# Altium schematic sheet Ethernet.SchDoc: Ethernet PHY with RJ45 connector
size A4; Author: A.B; CompanyName: STMicroelectronics; Address1: 12, Rue Jules HOROWITZ; Address2: 38019 Grenoble; Address3: FRANCE; DocumentNumber: MB1137; Revision: B-01; SheetNumber: 5; SheetTotal: 6; Project: NUCLEO-XXXXZX
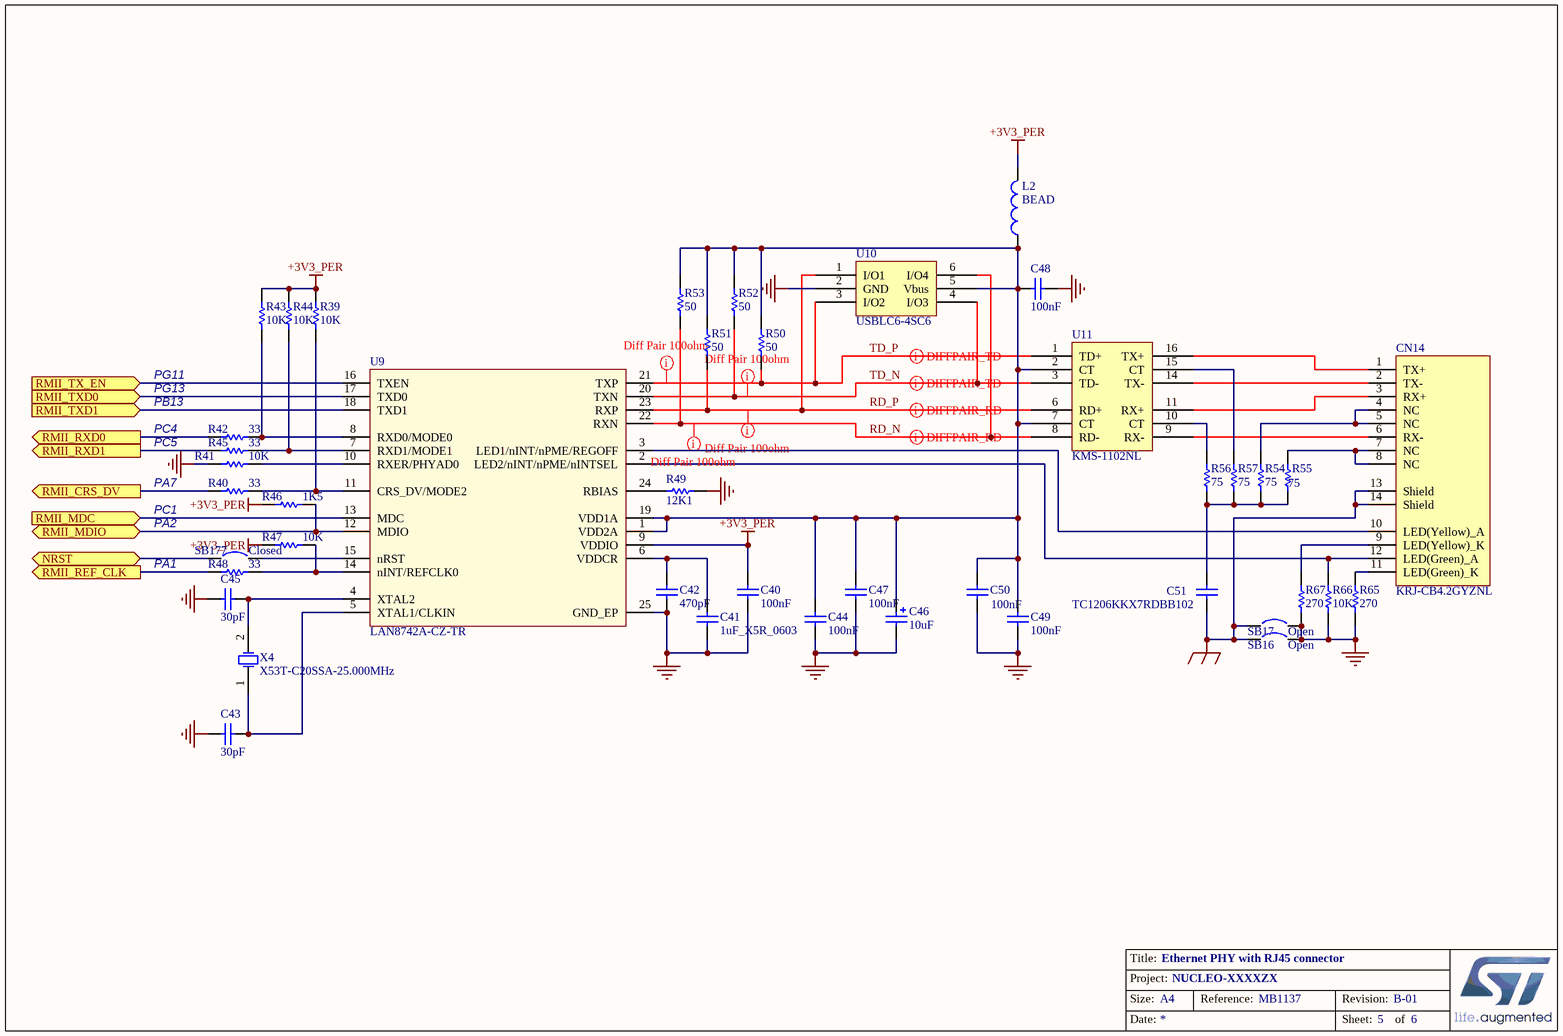
[diagram p0: Ethernet.SchDoc]

## Parts
C40  100nF  [0603C]
C41  1uF_X5R_0603  [0603C]
C42  470pF  [0603C]
C43  30pF  [0603C]
C44  100nF  [0603C]
C45  30pF  [0603C]
C46  10uF  [TAN-A]
C47  100nF  [0603C]
C48  100nF  [0603C]
C49  100nF  [0603C]
C50  100nF  [0603C]
C51  TC1206KKX7RDBB102  [1206C]
CN14  KRJ-CB4.2GYZNL  [RJ45_KRJ-CB4.2GYZNL]
L2  BEAD  [0603L]
R39  10K  [0603R]
R40  33  [0603R]
R41  10K  [0603R]
R42  33  [0603R]
R43  10K  [0603R]
R44  10K  [0603R]
R45  33  [0603R]
R46  1K5  [0603R]
R47  10K  [0603R]
R48  33  [0603R]
R49  12K1  [0603R]
R50  50  [0603R]
R51  50  [0603R]
R52  50  [0603R]
R53  50  [0603R]
R54  75  [0603R]
R55  75  [0603R]
R56  75  [0603R]
R57  75  [0603R]
R65  270  [0603R]
R66  10K  [0603R]
R67  270  [0603R]
SB16  Open  [SB_0603]
SB17  Open  [SB_0603]
SB177  Closed  [SB_0603]
U9  LAN8742A-CZ-TR  [QFN24_0R5_4X4]
U10  USBLC6-4SC6  [SOT23-6L]
U11  KMS-1102NL  [Transformer]
X4  X53T-C20SSA-25.000MHz  [XTAL_2SM_5R0X3R2]

## Ports
NRST, RMII_CRS_DV (out), RMII_MDC (in), RMII_MDIO (bidir), RMII_REF_CLK (out), RMII_RXD0 (out), RMII_RXD1 (out), RMII_TX_EN (in), RMII_TXD0 (in), RMII_TXD1 (in)

## Nets
+3V3_PER: C40.2 L2.2 R39.1 R43.1 R44.1 R46.2 R47.1 U9.9(VDDIO)
EGND: C51.1 CN14.13(Shield) CN14.14(Shield) SB16.1 SB17.1
GND: C40.1 C41.2 C42.1 C43.2 C44.1 C45.2 C46.2 C47.1 C48.1 C49.1 C50.1 R41.2 R49.2 R65.2 R66.2 R67.2 SB16.2 SB17.2 U9.25(GND_EP) U10.2(GND)
NRST: SB177.1 ; port NRST
RD_N: R53.1 U9.22(RXN) U10.6(I/O4) U11.8(RD-)
RD_P: R51.1 U9.23(RXP) U10.1(I/O1) U11.6(RD+)
RMII_CRS_DV: R40.2 ; port RMII_CRS_DV
RMII_MDC: U9.13(MDC) ; port RMII_MDC
RMII_MDIO: R46.1 U9.12(MDIO) ; port RMII_MDIO
RMII_REF_CLK: R48.2 ; port RMII_REF_CLK
RMII_RXD0: R42.2 ; port RMII_RXD0
RMII_RXD1: R45.2 ; port RMII_RXD1
RMII_TX_EN: U9.16(TXEN) ; port RMII_TX_EN
RMII_TXD0: U9.17(TXD0) ; port RMII_TXD0
RMII_TXD1: U9.18(TXD1) ; port RMII_TXD1
TD_N: R52.1 U9.20(TXN) U10.4(I/O3) U11.3(TD-)
TD_P: R50.1 U9.21(TXP) U10.3(I/O2) U11.1(TD+)
NetC41_1: C41.1 C42.2 U9.6(VDDCR)
NetC43_1: C43.1 U9.5(XTAL1/CLKIN) X4.1(OSC1)
NetC44_2: C44.2 C46.1 C47.2 C48.2 C49.2 C50.2 L2.1 R50.2 R51.2 R52.2 R53.2 U9.1(VDD2A) U9.19(VDD1A) U10.5(Vbus) U11.2(CT) U11.7(CT)
NetC45_1: C45.1 U9.4(XTAL2) X4.2(OSC2)
NetC51_2: C51.2 R54.1 R55.1 R56.1 R57.1
NetCN14_1: CN14.1(TX+) U11.16(TX+)
NetCN14_2: CN14.2(TX-) U11.14(TX-)
NetCN14_3: CN14.3(RX+) U11.11(RX+)
NetCN14_4: CN14.4(NC) CN14.5(NC) R54.2
NetCN14_6: CN14.6(RX-) U11.9(RX-)
NetCN14_7: CN14.7(NC) CN14.8(NC) R55.2
NetCN14_9: CN14.9(LED(Yellow)_K) R67.1
NetCN14_10: CN14.10(LED(Yellow)_A) U9.3(LED1/nINT/nPME/REGOFF)
NetCN14_11: CN14.11(LED(Green)_K) R65.1
NetCN14_12: CN14.12(LED(Green)_A) R66.1 U9.2(LED2/nINT/nPME/nINTSEL)
NetR39_2: R39.2 R40.1 U9.11(CRS_DV/MODE2)
NetR41_1: R41.1 U9.10(RXER/PHYAD0)
NetR42_1: R42.1 R43.2 U9.8(RXD0/MODE0)
NetR44_2: R44.2 R45.1 U9.7(RXD1/MODE1)
NetR47_2: R47.2 R48.1 U9.14(nINT/REFCLK0)
NetR49_1: R49.1 U9.24(RBIAS)
NetR56_2: R56.2 U11.10(CT)
NetR57_2: R57.2 U11.15(CT)
NetSB177_2: SB177.2 U9.15(nRST)

## Layout directives
differential pair: RD_N, RD_P, TD_N, TD_P
rule Matched Net Lengths [Tolerance = 100mil]: RD_N, RD_P, TD_N, TD_P

## Notes on the sheet
- PG11
- PG13
- PB13
- PC4
- PC5
- PA7
- PC1
- PA2
- PA1
- Title:
- Project:
- Size:
- Date:
- A4
- Reference:
- Sheet:
- Revision:
- of

## Library data of the parts
C40 C44 C47-C50 = Capacitor_ST: Capacitor 0402 / 0603 / 0805; Revision: July-2002: Re-released for DXP Platform.; Value: 100nF
C41 = CAP SMD 0603  X5R 1µF 25V 10%: 0603  X5R 1µF; Rated voltage: 25V; Tolerance: 10%; Manufacturer: *; Manufacturer P/N: *; Order code Farnell: 1288202RL; Value: 1µF; Power: *; Technology: X5R; Temperature  Factor: *; Temperature Max: +125°C; Temperature Min: -55°C; STS Code: *
C42 C43 C45 = Capacitor_ST: Capacitor 0402 / 0603 / 0805; Value: 100nF; Revision: July-2002: Re-released for DXP Platform.
C46 = Cap_10uF_POL_10%_TANA: Polarized Capacitor,10uF,10V,10%,typeA,VISHAY; Manuf_Part_1: 293D106X9010A2TE3; Revision: July-2002: Re-released for DXP Platform.; Value: 10uF; Manuf_1: VISHAY; Order: *; ECCN_US/EU: n/a
C51 = Capacitor_ST: Capacitor 0402 / 0603 / 0805/ 1206; Value: 100nF; Revision: July-2002: Re-released for DXP Platform.
CN14 = KRJ-CB4.2GYZNL: 100 Base-TX (Fast Ethernet) SMD RJ45 single port (1x1) with LEDS Integrated Magnetics Connector; Manuf_1: HanRun; Manuf_Part_1: HR961160C; Manuf_2: Pulse Electronics Corporation; Manuf_Part_2: J3011G21DNLT; Manuf_3: K.O.D International Holding; Manuf_Part_3: RMT-119A-12F6-GY-04; Distrib: Sub Co; Order: *
L2 = Inductor: Value: 100uH; Published: 8-Jun-2000; Revision: July-2002: Re-released for DXP Platform.; Publisher: Altium Limited
R39 R41 R43 R44 R47 R66 = Resistor_ST: Resistor 0402 / 0603 / 0805; Description: Resistor 0402 or 0603 or 0805; Value: 10K
R40 R42 R45 R48 = Res_33_1%_0402: Resistor,33,0402,1%,YAGEO; Manuf_Part_1: RC0402FR-0733RL; Value: 33; Manuf_1: YAGEO; Order: *; ECCN_US/EU: n/a; Distrib: FARNELL
R46 = Res_1K5_1%_0402: Resistor,1K5,0402,1%,YAGEO; Manuf_Part_1: RC0402FR-071K5L; Value: 1K5; Manuf_1: YAGEO; Order: RC0402FR-071K5L; ECCN_US/EU: n/a; Distrib: FARNELL
R49 = Res_12K1_1%_0603: Resistor,12K1,0603,1%,VISHAY; Manuf_Part_1: MCT 0603-50 1% P5 12K1; Order: 2325243; Value: 12K1; ECCN_US/EU: n/a; Manuf_1: VISHAY; Distrib: FARNELL
R50-R53 = Res_50_1%_0603: Resistor,50,0603,1%,YAGEO; Manuf_Part_1: RC0402FR-0750RL; Description: Resistor,50,0402,1%,YAGEO; Value: 50; Manuf_1: YAGEO; Order: *; ECCN_US/EU: n/a; Distrib: FARNELL
R54-R57 = Res_75_1%_0603: Resistor,75,0603,1%,YAGEO; Manuf_Part_1: RC0402FR-0750RL; Description: Resistor,50,0402,1%,YAGEO; Value: 50; Manuf_1: YAGEO; Order: *; ECCN_US/EU: n/a; Distrib: FARNELL
R65 R67 = Resistor_ST: Resistor 0402 / 0603 / 0805; Description: Resistor 0402 or 0603 or 0805; Value: 10K
SB16 SB17 = Circuit Breaker: Published: 24-Mar-1999; Revision: July-2002: Re-released for DXP Platform.; Publisher: Altium Limited
SB177 = Circuit Breaker_close: Circuit Breaker; Published: 24-Mar-1999; Revision: July-2002: Re-released for DXP Platform.; Publisher: Altium Limited
U9 = LAN8742A-CZ-TR: LAN8742A-CZ-TR - Small Footprint RMII 10/100 Ethernet, Transceiver with HP Auto-MDIX and flexPWR Technology SQFN-24; Manuf_1: MICROCHIP; Order: LAN8742A-CZ-TR; Manuf_Part_1: LAN8742A-CZ-TR; Distrib: MICROCHIP
X4 = XTAL_5032: Crystal Oscillator; Published: 8-Jun-2000; LatestRevisionDate: 17-Jul-2002; LatestRevisionNote: Re-released for DXP Platform.; PackageReference: R38; Publisher: Altium Limited